# Altium project pilar_3.PrjPcb
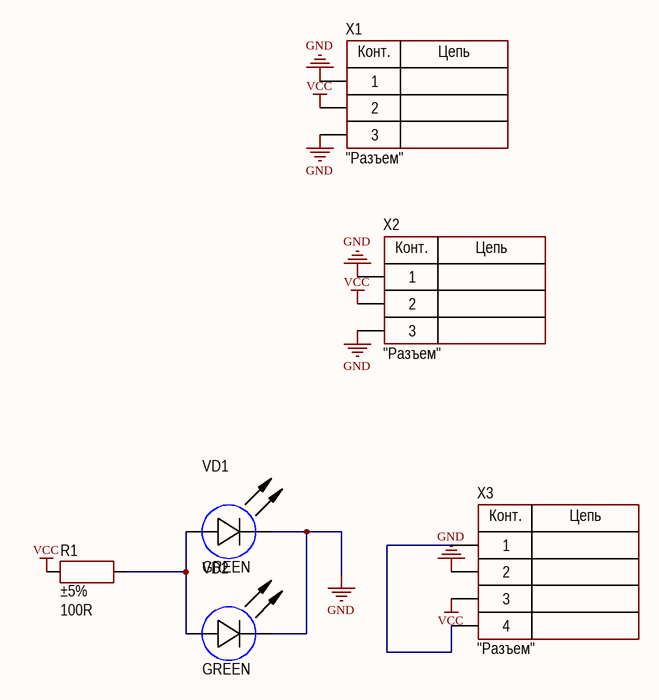
[diagram p0: pilar_3.SchDoc]
1 sheet, 6 parts. Net scope: global (net labels, ports and power ports of the same name join across sheets).
Board file: pilar_3.PcbDoc

## Sheet pilar_3.SchDoc
size 420 x 297 mm; Address1: Address1; Address2: Address2; Address3: Address3; Address4: Address4; DocumentNumber: АБВГ.123456.001 Э3; SheetNumber: 1; Scale: 1:1; DocumentType: Схема электрическая принципиальная; FirstReferrence: АБВГ.123456.001

### Parts
R1  value 100R  Tolerance: ±5%  [RES: 0603]
VD1  Color: GREEN  [LED: 0805R]
VD2  Color: GREEN  [LED: 0805R]
X1  CommentText: "Разъем"  [CON: PLS-3]
X2  CommentText: "Разъем"  [CON: PLS-3]
X3  CommentText: "Разъем"  [4PLS RIGHT ANGLE 2]

### Nets
GND: VD1.2(C) VD2.2(C) X1.1 X1.3 X2.1 X2.3 X3.2
VCC: R1.1 X1.2 X2.2 X3.3
NetR1_2: R1.2 VD1.1(A) VD2.1(A)
NetX3_1: X3.1 X3.4

### Notes on the sheet
- Перв. примен.
- Справ. №
- Подп. и дата
- Инв. № дубл.
- Взам. инв. №
- Разраб.
- Изм.
- Лист
- № докум.
- Подп.
- Дата
- Лит.
- Масса
- Масштаб
- Пров.
- Т.контр.
- Листов
- Инв. № подл.
- Утв.
- Н.контр.
- 2.106-A3
- Копировал
- Формат А3
- (in symbol PLS-3) Конт.; Цепь
- (in symbol PLS-4) Конт.; Цепь

### Library data of the parts
R1 = Resistor_0603: Manufacturer: Yageo; PartNumber: RC0603JR-07100RL; ValueManufacturerPartNumber: Resistor film, 100R, ±5%, 0603, 0.1W, -55...+125°C; TypeResistor: Resistor film; Power: 0.1W; Package: 0603; HelpURL: https://www.digikey.com/product-detail/en/yageo/RC0603JR-07100RL/311-100GRCT-ND/729644; Temperature: -55...+125°C
VD1 VD2 = LED_single: ValueManufacturerPartNumber: LED, *, *, *, -55...+150°C; TypeDiode: LED; Manufacturer: *; Package: *; HelpURL: *; Temperature: -55...+150°C; Current: *; VoltageDrop: *; PartNumber: *
X1 X2 = PLS-3: Manufacturer: Connfly; ValueManufacturerPartNumber: Connector, 3pin, 2.54mm, 500VAC, 3A; TypeConnector: Connector; VoltageMax: 500VAC; Pitch: 2.54mm; CurrentMax: 3A; Multichannel: 3pin; HelpURL: https://www.chipdip.ru/product/pls-3; PartNumber: PLS-3
X3 = PLS-4: Manufacturer: Connfly; ValueManufacturerPartNumber: Connector, 4pin, 2.54mm, 500VAC, 3A; TypeConnector: Connector; VoltageMax: 500VAC; Pitch: 2.54mm; CurrentMax: 3A; Multichannel: 4pin; HelpURL: https://www.chipdip.ru/product/pls-4; PartNumber: PLS-4